# Altium schematic sheet Core.SchDoc
size A; SheetNumber: 1; SheetTotal: 1
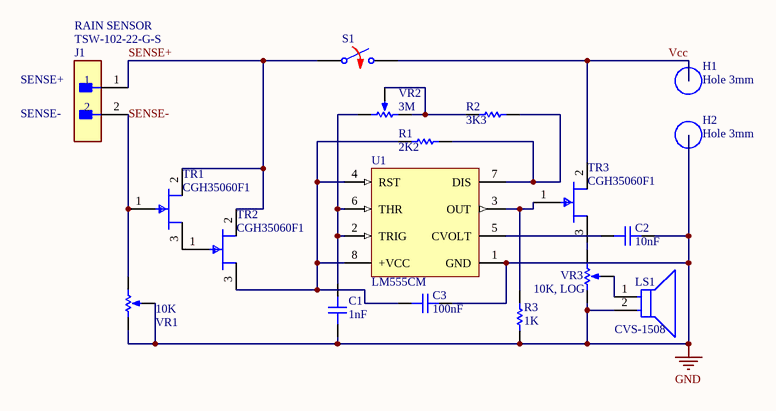
[diagram p0: Core.SchDoc]

## Parts
C1  1nF  [CAP_0201]
C2  10nF  [CAP_0201]
C3  100nF  [CAP_0201]
H1  Hole 3mm  [Hole 3mm]
H2  Hole 3mm  [Hole 3mm]
J1  TSW-102-22-G-S  [FP-TSW-102-22-G-S-MFG]
LS1  CVS-1508  [FP-CVS-1508-MFG]
R1  value 2K2  (hidden comment: Resistor)
R2  value 3K3  (hidden comment: Resistor)
R3  value 1K  (hidden comment: Resistor)
S1  Switch Normally Opened  (value not drawn)
TR1  CGH35060F1  [FP-440193-IPC_C]
TR2  CGH35060F1  [FP-440193-IPC_C]
TR3  CGH35060F1  [FP-440193-IPC_C]
U1  LM555CM  [D0008A_L]
VR1  value 10K  [CT2260-ND]  (hidden comment: RPot_7)
VR2  value 3M  [CT2260-ND]  (hidden comment: RPot_7)
VR3  value 10K, LOG  [CT2260-ND]  (hidden comment: RPot_7)

## Nets
GND: C1.1 C2.2 C3.2 LS1.2(A) R3.2 U1.1(GND) VR1.1(TOP) VR1.2(TAP) VR3.1(TOP)
SENSE+: J1.1 S1.1 TR1.2(DRAIN) TR2.2(DRAIN)
SENSE-: J1.2 TR1.1(GATE) VR1.3(BOT)
Vcc: S1.2 TR3.2(DRAIN)
NetC1_2: C1.2 U1.2(TRIG) U1.6(THR) VR2.3(BOT)
NetC2_1: C2.1 U1.5(CVOLT)
NetC3_1: C3.1 R1.1 TR2.3(SOURCE) U1.4(RST) U1.8(+VCC)
NetLS1_1: LS1.1(C) VR3.2(TAP)
NetR1_2: R1.2 R2.2 U1.7(DIS)
NetR2_1: R2.1 VR2.1(TOP) VR2.2(TAP)
NetR3_1: R3.1 TR3.1(GATE) U1.3(OUT)
NetTR1_3: TR1.3(SOURCE) TR2.1(GATE)
NetTR3_3: TR3.3(SOURCE) VR3.3(BOT)

## Notes on the sheet
- RAIN SENSOR
- (near J1) SENSE+
- (near J1) SENSE-

## Library data of the parts
C1-C3 = CAP_0201: Capacitor SMD 0201; Manufacturer: *; Manufacturer Part Number: *; Distributor Link: *; LCSC: *; Rating: *; Dielectric: *
J1 = CMP-02766-000117-1: CONN HEADER VERT 2POS 2.54MM; Max Voltage Rating (AC): 550V; Gender: Male; Max Current Rating: 7.6A; Number of Contacts: 2; Housing Color: Black; Max Operating Temperature: 125°C; Orientation: Straight; Depth: 2.54mm; Pitch: 2.54mm; Housing Material: Polyester; Packaging: Bulk; Termination: Solder; Contact Plating: Gold; Length: 5.08mm; Number of Rows: 1; Radiation Hardening: No; Min Operating Temperature: -55°C; REACH SVHC: No SVHC; Contact Material: Bronze
LS1 = CMP-14846-000001-1: SPEAKER 8OHM 300MW TOP PORT 87DB; Manufacturer: CUI Inc; Resistance: 8Ω; Value: 8Ω; Frequency: 1700Hz; Package: CVS-1508; Device Class L1: Electromechanical; Manufacturer Part Number: CVS-1508; Mouser Description: Speakers & Transducers Speakers; Temperature Range High: +55°C; Octopart: https://octopart.com/cvs-1508-cui-21325683; Device Class L2: Audio Products; Temperature Range Low: -20°C; Category: Speak; Digikey Description: SPEAKER 8OHM 300MW TOP PORT 87DB; Temperature: -20°C to +55°C; Height: 8mm; ComponentLink2Description: Datasheet; ComponentLink2URL: https://www.cui.com/product/resource/cvs-1508.pdf; Device Class L3: Speakers; Lead Free: Yes; RoHS: TRUE; Automotive: No
R1-R3 = Resistor: TC1: 0; SimulationGenericComponent: True; TC2: 0
S1 = SW NO: closed: 0; Rclosed: 1m; Ropen: 1Meg; SimulationGenericComponent: True
TR1-TR3 = CMP-240936-000107-1: RF Mosfet HEMT 28 V 250 mA 3.3-3.6GHz 11.5dB 60W 440193
U1 = CMP-0056-00108-3: Timer, 8-pin Narrow SOIC; Manufacturer: Texas Instruments; CompType: Analog IC; PackageTopMarking: NSZXTT*LM*555CM; PowerWise: N; PackageDescription: SOIC Narrow, 4.9 x 3.9 x 1.45mm, 8 Lead, 1.27mm Pitch; RoHS: N; Code_IPC: SOIC127P600-8; ComponentLink1Description: Datasheet URL; ComponentLink1URL: http://www.ti.com/general/docs/lit/getliterature.tsp?genericPartNumber=LM555&fileType=pdf; PinCount: 8; Code_JEDEC: MS-012-AA; PackageReference: D0008A
VR1-VR3 = RPot_4: Potentiometer; Sim Note: Enter the Resistance value and the set point into parameter fields.; Set Position: 0.5; Published: 8-Jun-2000; LatestRevisionDate: 17-Jul-2002; LatestRevisionNote: Re-released for DXP Platform.; PackageReference: VR5; Publisher: Altium Limited; PackageDescription: Variable Resistor, Thru-Hole; 3 Leads